# EAGLE design osbo_v10 (EAGLE 6.4)
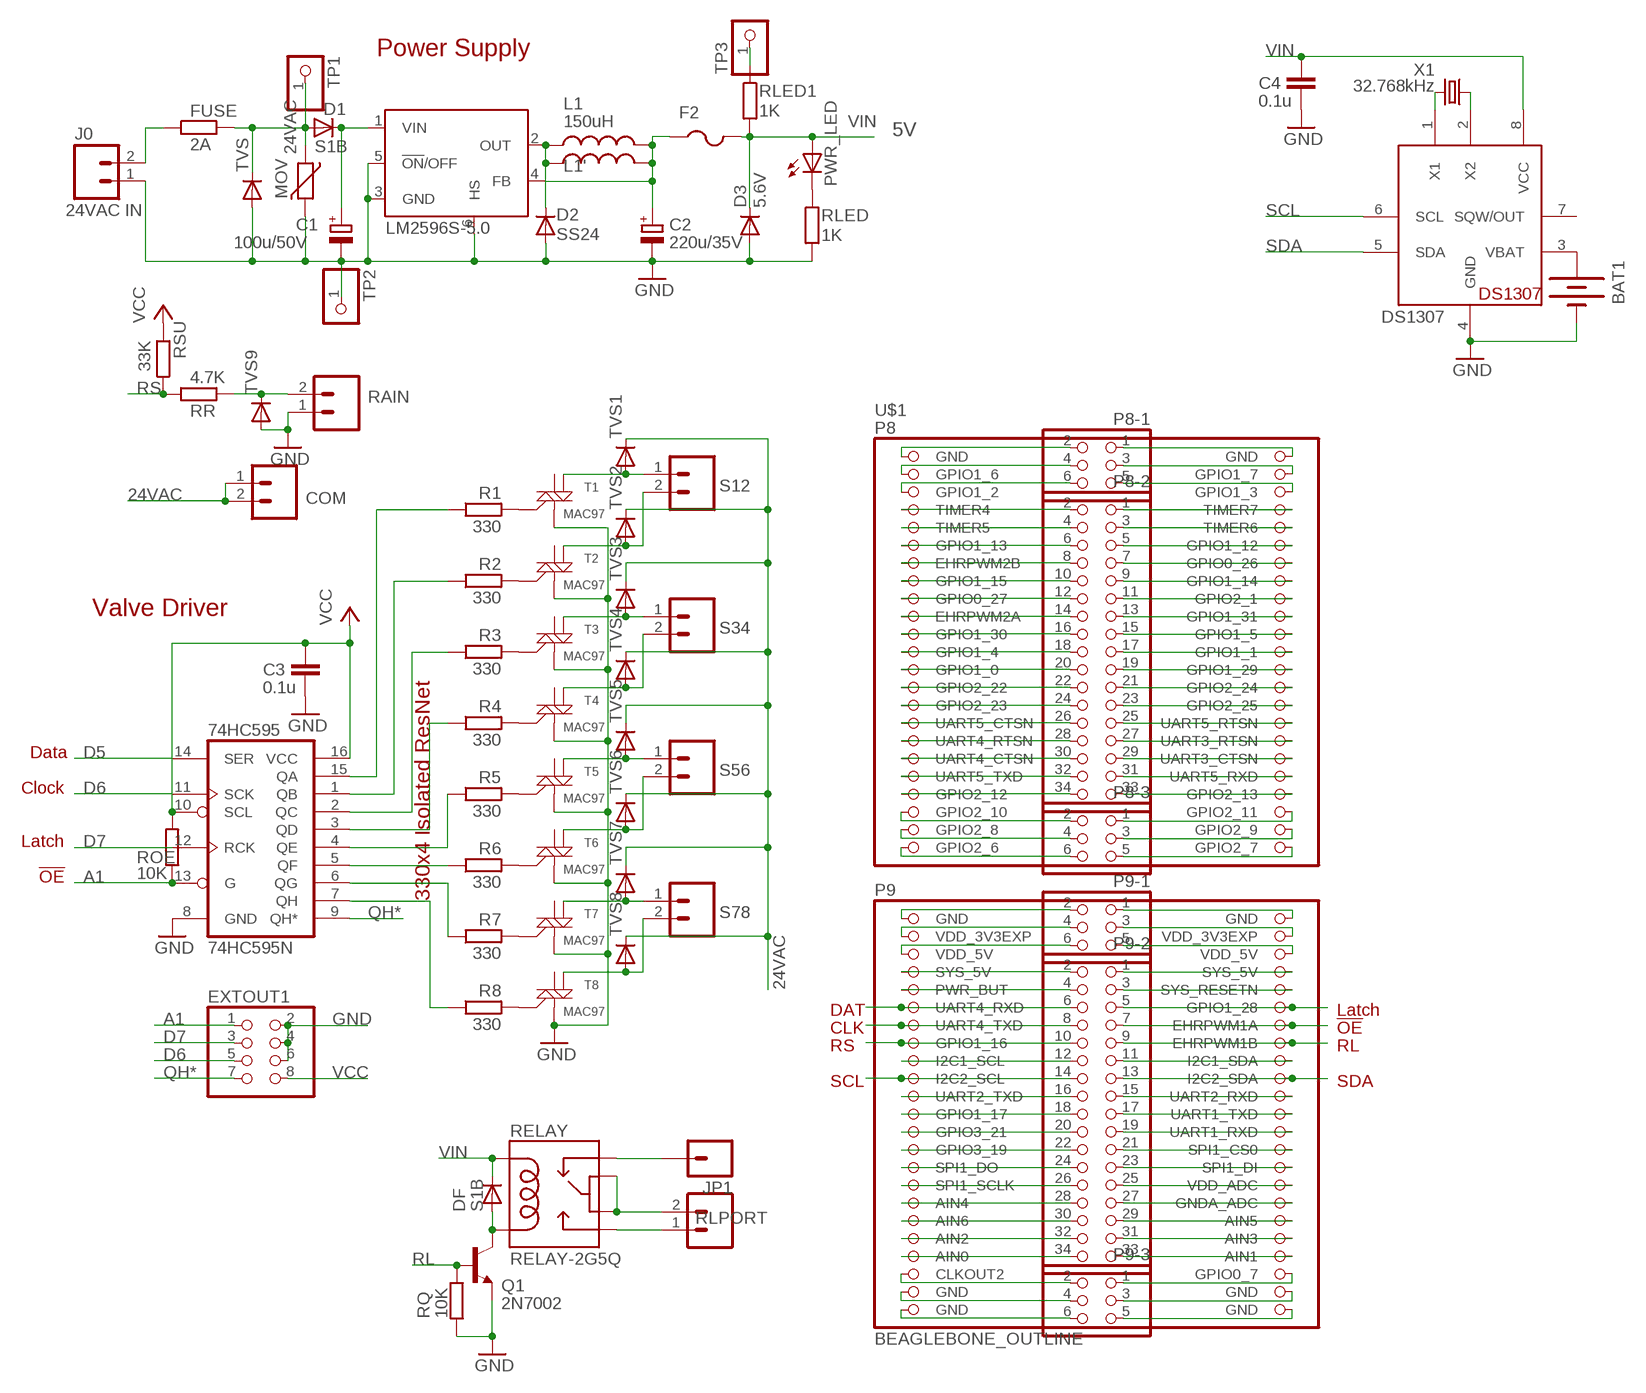
[diagram p0: schematic, sheet 1]

## Parts
74HC595  74HC595N  74LS595D  [SO16]
BAT1  BATTERYBATTERY_12MM_SMT  [BATTCON_12MM_SMT]
C1  100u/50V  CPOL-EUE  [PANASONIC_E]
C2  220u/35V  CPOL-EUE  [PANASONIC_E]
C3  0.1u  C-EUC0805  [C0805]
C4  0.1u  C-EUC0805  [C0805]
COM  M025MM-X  [SCREWTERMINAL-5MM-2-X]
D1  S1B  DIODE-DO-214AC  [DO-214AC]
D2  SS24  DIODE-SMB  [SMB]
D3  5.6V  DIODE-MINIMELF  [MINIMELF]
DF  S1B  DIODE-DO-214AC  [DO-214AC]
DS1307  DS1307  DS1307SOIC  [SO08]
EXTOUT1  PINHD-2X4/90  [2X04/90]
F2  PTCFUSE-1812  [1812]
FUSE  2A  R-EU_0411/15  [0411/15]
IC1  LM2596S-5.0  LM2596S  [TO263-5]
J0  24VAC IN  M024MM-X  [SCREWTERMINAL-4MM-2-X]
JP1  M01PTH  [1X01]
L1  150uH  INDUCTORPWR  [CDRH125]
L1'  150uH  L-US0207/7  [0207/7]
MOV  VARISTOR-5  [R-5]
P8-1  PINHD-2X3  [2X03]
P8-2  PINHD-2X17  [2X17]
P8-3  PINHD-2X3  [2X03]
P9-1  PINHD-2X3  [2X03]
P9-2  PINHD-2X17  [2X17]
P9-3  PINHD-2X3  [2X03]
PWR_LED  LEDCHIPLED_0805  [CHIPLED_0805]
Q1  2N7002  TRANSISTOR_NPNSOT23-3  [SOT23-3]
R1  330  R-EU_R0805  [R0805]
R2  330  R-EU_R0805  [R0805]
R3  330  R-EU_R0805  [R0805]
R4  330  R-EU_R0805  [R0805]
R5  330  R-EU_R0805  [R0805]
R6  330  R-EU_R0805  [R0805]
R7  330  R-EU_R0805  [R0805]
R8  330  R-EU_R0805  [R0805]
RAIN  M025MM-X  [SCREWTERMINAL-5MM-2-X]
RELAY  RELAY-2G5Q  [RELAY-G5V]
RLED  1K  R-EU_R0805  [R0805]
RLED1  1K  R-EU_R0805  [R0805]
RLPORT  M025MM  [SCREWTERMINAL-5MM-2]
ROE  10K  R-EU_R0805  [R0805]
RQ  10K  R-EU_R0805  [R0805]
RR  4.7K  R-EU_R0805  [R0805]
RSU  33K  R-EU_R0805  [R0805]
S12  M025MM-X  [SCREWTERMINAL-5MM-2-X]
S34  M025MM-X  [SCREWTERMINAL-5MM-2-X]
S56  M025MM-X  [SCREWTERMINAL-5MM-2-X]
S78  M025MM-X  [SCREWTERMINAL-5MM-2-X]
T1  MAC97  MAC97SOT223  [SOT223]
T2  MAC97  MAC97SOT223  [SOT223]
T3  MAC97  MAC97SOT223  [SOT223]
T4  MAC97  MAC97SOT223  [SOT223]
T5  MAC97  MAC97SOT223  [SOT223]
T6  MAC97  MAC97SOT223  [SOT223]
T7  MAC97  MAC97SOT223  [SOT223]
T8  MAC97  MAC97SOT223  [SOT223]
TP1  PINHD-1X1CB  [1X01-CLEANBIG]
TP2  PINHD-1X1CB  [1X01-CLEANBIG]
TP3  PINHD-1X1CB  [1X01-CLEANBIG]
TVS  DIODE-SMB  [SMB]
TVS1  DIODE-SMB  [SMB]
TVS2  DIODE-SMB  [SMB]
TVS3  DIODE-SMB  [SMB]
TVS4  DIODE-SMB  [SMB]
TVS5  DIODE-SMB  [SMB]
TVS6  DIODE-SMB  [SMB]
TVS7  DIODE-SMB  [SMB]
TVS8  DIODE-SMB  [SMB]
TVS9  DIODE-SMB  [SMB]
U$1  BEAGLEBONE_OUTLINE  [BEAGLEBONE_SHIELD]
X1  32.768kHz  CRYSTALMM20SS  [MM20SS]

## Nets
24VAC [power]: COM.1 COM.2 D1.A FUSE.2 MOV.1 TP1.1 TVS1.C TVS2.C TVS3.C TVS4.C TVS5.C TVS6.C TVS7.C TVS8.C TVS.C
A1: 74HC595.13(G) EXTOUT1.1 P9-2.7 ROE.1 U$1.60(EHRPWM1A)
ACIN [power]: FUSE.1 J0.2
CO [power]: RELAY.5 RELAY.6 RLPORT.2
D5: 74HC595.14(SER) P9-2.6 U$1.57(UART4_RXD)
D6: 74HC595.11(SCK) EXTOUT1.5 P9-2.8 U$1.59(UART4_TXD)
D7: 74HC595.12(RCK) EXTOUT1.3 P9-2.5 U$1.58(GPIO1_28)
G5: R5.2 T5.3(G)
GND [power]: 74HC595.8(GND) BAT1.P$1(-) C1.- C2.- C3.2 C4.2 D2.A D3.A DS1307.4(GND) EXTOUT1.2 EXTOUT1.4 EXTOUT1.6 IC1.3(GND) IC1.5(!ON!/OFF) IC1.6(HS) J0.1 MOV.2 P9-1.1 P9-1.2 Q1.2(E) RAIN.1 RLED.2 RQ.2 T1.1(M1) T2.1(M1) T3.1(M1) T4.1(M1) T5.1(M1) T6.1(M1) T7.1(M1) T8.1(M1) TP2.1 TVS9.A TVS.A U$1.47(GND) U$1.48(GND)
I2C1_SCL: P9-2.12 U$1.63(I2C1_SCL)
I2C1_SDA: P9-2.11 U$1.64(I2C1_SDA)
N$1: PWR_LED.C RLED.1
N$2 [power]: C1.+ D1.C IC1.1(VIN)
N$3: R1.2 T1.3(G)
N$4: 74HC595.5(QF) R6.1
N$5: 74HC595.6(QG) R7.1
N$6: BAT1.P$2(+) DS1307.3(VBAT)
N$7: 74HC595.7(QH) R8.1
N$8 [power]: D2.C IC1.2(OUT) L1'.1 L1.1
N$9: P8-1.2 U$1.1(GND)
N$10: 74HC595.4(QE) R5.1
N$11: 74HC595.3(QD) R4.1
N$12: 74HC595.2(QC) R3.1
N$13: 74HC595.1(QB) R2.1
N$14: 74HC595.15(QA) R1.1
N$15: R2.2 T2.3(G)
N$16 [power]: S12.1 T1.4(M2-4) TVS1.A
N$17 [power]: S12.2 T2.4(M2-4) TVS2.A
N$18 [power]: S34.1 T3.4(M2-4) TVS3.A
N$19: R3.2 T3.3(G)
N$20 [power]: S34.2 T4.4(M2-4) TVS4.A
N$21: R4.2 T4.3(G)
N$22 [power]: S56.1 T5.4(M2-4) TVS5.A
N$23 [power]: S56.2 T6.4(M2-4) TVS6.A
N$24 [power]: S78.1 T7.4(M2-4) TVS7.A
N$25 [power]: S78.2 T8.4(M2-4) TVS8.A
N$26: RAIN.2 RR.1 TVS9.C
N$27: R6.2 T6.3(G)
N$28: R7.2 T7.3(G)
N$29: R8.2 T8.3(G)
N$30: P8-1.1 U$1.2(GND)
N$31: DS1307.1(X1) X1.1
N$32: P8-1.4 U$1.3(GPIO1_6)
N$33: P8-1.3 U$1.4(GPIO1_7)
N$34: P8-1.6 U$1.5(GPIO1_2)
N$35: P8-1.5 U$1.6(GPIO1_3)
N$36: P8-3.6 U$1.45(GPIO2_6)
N$37: P8-3.5 U$1.46(GPIO2_7)
N$38: P8-3.4 U$1.43(GPIO2_8)
N$39: P8-3.2 U$1.41(GPIO2_10)
N$40: P8-3.3 U$1.44(GPIO2_9)
N$41: P8-3.1 U$1.42(GPIO2_11)
N$42: P8-2.2 U$1.7(TIMER4)
N$43: P8-2.4 U$1.9(TIMER5)
N$44: P8-2.6 U$1.11(GPIO1_13)
N$45: P8-2.8 U$1.13(EHRPWM2B)
N$46: P8-2.10 U$1.15(GPIO1_15)
N$47: P8-2.12 U$1.17(GPIO0_27)
N$48: P8-2.14 U$1.19(EHRPWM2A)
N$49: P8-2.16 U$1.21(GPIO1_30)
N$50: P8-2.18 U$1.23(GPIO1_4)
N$51: P8-2.20 U$1.25(GPIO1_0)
N$52: P8-2.22 U$1.27(GPIO2_22)
N$53: P8-2.24 U$1.29(GPIO2_23)
N$54: P8-2.26 U$1.31(UART5_CTSN)
N$55: P8-2.28 U$1.33(UART4_RTSN)
N$56: P8-2.30 U$1.35(UART4_CTSN)
N$57: P8-2.32 U$1.37(UART5_TXD)
N$58: P8-2.34 U$1.39(GPIO2_12)
N$59: P8-2.1 U$1.8(TIMER7)
N$60: P8-2.3 U$1.10(TIMER6)
N$61: P8-2.5 U$1.12(GPIO1_12)
N$62: P8-2.7 U$1.14(GPIO0_26)
N$63: P8-2.9 U$1.16(GPIO1_14)
N$64: P8-2.11 U$1.18(GPIO2_1)
N$65: P8-2.13 U$1.20(GPIO1_31)
N$66: P8-2.15 U$1.22(GPIO1_5)
N$67: P8-2.17 U$1.24(GPIO1_1)
N$68: P8-2.19 U$1.26(GPIO1_29)
N$69: P8-2.21 U$1.28(GPIO2_24)
N$70: P8-2.23 U$1.30(GPIO2_25)
N$71: P8-2.25 U$1.32(UART5_RTSN)
N$72: P8-2.27 U$1.34(UART3_RTSN)
N$73: P8-2.29 U$1.36(UART3_CTSN)
N$74: P8-2.31 U$1.38(UART5_RXD)
N$75: P8-2.33 U$1.40(GPIO2_13)
N$76: DS1307.2(X2) X1.4
N$77 [power]: DF.A Q1.3(C) RELAY.9
N$78 [power]: RLED1.1 TP3.1
N$82: P9-3.6 U$1.91(GND)
N$83: P9-3.4 U$1.89(GND)
N$84: P9-3.2 U$1.87(CLKOUT2)
N$85: P9-3.5 U$1.92(GND)
N$86: P9-3.3 U$1.90(GND)
N$87: P9-3.1 U$1.88(GPIO0_7)
N$95: P9-2.15 U$1.68(UART2_RXD)
N$96: P9-2.17 U$1.70(UART1_TXD)
N$97: P9-2.19 U$1.72(UART1_RXD)
N$98: P9-2.21 U$1.74(SPI1_CS0)
N$99: P9-2.23 U$1.76(SPI1_DI)
N$100: P9-2.25 U$1.78(VDD_ADC)
N$101: P9-2.27 U$1.80(GNDA_ADC)
N$102: P9-2.29 U$1.82(AIN5)
N$103: P9-2.31 U$1.84(AIN3)
N$104: P9-2.33 U$1.86(AIN1)
N$112: P9-2.16 U$1.67(UART2_TXD)
N$113: P9-2.18 U$1.69(GPIO1_17)
N$114: P9-2.20 U$1.71(GPIO3_21)
N$115: P9-2.22 U$1.73(GPIO3_19)
N$116: P9-2.24 U$1.75(SPI1_DO)
N$117: P9-2.26 U$1.77(SPI1_SCLK)
N$118: P9-2.28 U$1.79(AIN4)
N$119: P9-2.30 U$1.81(AIN6)
N$120: P9-2.32 U$1.83(AIN2)
N$121: P9-2.34 U$1.85(AIN0)
NC [power]: JP1.1 RELAY.1
NO [power]: RELAY.10 RLPORT.1
PWR_BUT: P9-2.4 U$1.55(PWR_BUT)
QH*: 74HC595.9(QH*) EXTOUT1.7
RL: P9-2.9 Q1.1(B) RQ.1 U$1.62(EHRPWM1B)
RS: P9-2.10 RR.2 RSU.1 U$1.61(GPIO1_16)
SCL: DS1307.6(SCL) P9-2.14 U$1.65(I2C2_SCL)
SDA: DS1307.5(SDA) P9-2.13 U$1.66(I2C2_SDA)
SYS_5V [power]: P9-2.1 P9-2.2 U$1.53(SYS_5V) U$1.54(SYS_5V)
SYS_RESET [power]: P9-2.3 U$1.56(SYS_RESETN)
VCC: 74HC595.10(SCL) 74HC595.16(VCC) C3.1 EXTOUT1.8 P9-1.3 P9-1.4 ROE.2 RSU.2 U$1.49(VDD_3V3EXP) U$1.50(VDD_3V3EXP)
VIN [power]: C4.1 D3.C DF.C DS1307.8(VCC) F2.2 P9-1.5 P9-1.6 PWR_LED.A RELAY.2 RLED1.2 U$1.51(VDD_5V) U$1.52(VDD_5V)
VIN_PRE [power]: C2.+ F2.1 IC1.4(FB) L1'.2 L1.2
Unconnected: DS1307.7(SQW/OUT) T1.2(M2) T2.2(M2) T3.2(M2) T4.2(M2) T5.2(M2) T6.2(M2) T7.2(M2) T8.2(M2)

## Notes on the sheet
- Power Supply
- 5V
- Valve Driver
- Data
- Clock
- Latch
- !OE
- 330x4 Isolated ResNet
- DAT | Latch
- CLK | !OE
- RS | RL
- SCL | SDA

## Library data of the parts
74HC595 = SparkFun:74*595: 8-bit SHIFT REGISTER, output latch
BAT1 = SparkFunNew:BATTERY: Battery Holders Various common sizes : AA, AAA, 20mm coin cell and 12mm coin cell.
C1 C2 = resistor:CPOL-EU: POLARIZED CAPACITOR, European symbol
C3 C4 = rcl:C-EU: CAPACITOR, European symbol
COM J0 RAIN RLPORT S12 S34 S56 S78 = SparkFun:M02: Header 2 Standard 2-pin 0.1" header. Use with straight break away headers (SKU : PRT-00116), right angle break away headers (PRT-00553), swiss pins (PRT-00743), machine pins (PRT-00117), and female headers (PRT-00115). Molex polarized connector foot print use with SKU : PRT-08233 with associated crimp pins and housings.
D1-D3 DF TVS TVS1-TVS9 = diode:DIODE-: DIODE
DS1307 = adafruit:DS1307: DS1307 Real time clock (RTC) with battery backup ability. Talk to it via i2c
EXTOUT1 = pinhead:PINHD-2X4: PIN HEADER
F2 = adafruit:PTCFUSE: PTC fuses, resettable thermistors
FUSE R1-R8 RLED RLED1 ROE RQ RR RSU = rcl:R-EU_: RESISTOR, European symbol
IC1 = national-semiconductor:LM2596: SIMPLE SWITCHER® Power Converter 150 kHz 3A Step-Down Voltage Regulator Source: http://www.national.com/ds/LM/LM2596.pdf; MF: NATIONAL SEMICONDUCTOR; MPN: LM2596S-ADJ/NOPB; OC_FARNELL: 9494367; OC_NEWARK: 41K3842
JP1 = SparkFun:M01: Header 1 Standard 1-pin 0.1" header. Use with straight break away headers (SKU : PRT-00116), right angle break away headers (PRT-00553), swiss pins (PRT-00743), machine pins (PRT-00117), and female headers (PRT-00115).
L1 = SparkFunNew:INDUCTOR: Inductors Basic Inductor/Choke - 0603 and 1206. Footprints are not proven and vary greatly between part numbers.
L1' = rcl:L-US: INDUCTOR, American symbol
MOV = varistor:VARISTOR: VARISTOR
P8-1 P8-3 P9-1 P9-3 = pinhead:PINHD-2X3: PIN HEADER
P8-2 P9-2 = pinhead:PINHD-2X17: PIN HEADER
PWR_LED = adafruit:LED: LED OSRAM: - CHIPLED LG R971, LG N971, LY N971, LG Q971, LY Q971, LO R971, LY R971 LH N974, LH R974 LS Q976, LO Q976, LY Q976 LO Q996 - Hyper CHIPLED LW Q18S LB Q993, LB Q99A, LB R99A - SideLED LS A670, LO A670, LY A670, LG A670, LP A670 LB A673, LV A673, LT A673, LW A673 LH A674 LY A675 LS A676, LA A676, LO A676, LY A676, LW A676 LS A679, LY A679, LG A679 - Hyper Micro SIDELED® LS Y876, LA Y876, LO Y876, LY Y876 LT Y87S - SmartLED LW L88C, LW L88S LB L89C, LB L89S, LG L890 LS L89K, LO L89K, LY L89K LS L896, LA L896, LO L896, LY L896 - TOPLED LS T670, LO T670, LY T670, LG T670, LP T670 LSG T670, LSP T670, LSY T670, LOP T670, LYG T670 LG T671, LOG T671, LSG T671 LB T673, LV T673, LT T673, LW T673 LH T674 LS T676, LA T676, LO T676, LY T676, LB T676, LH T676, LSB T676, LW T676 LB T67C, LV T67C, LT T67C, LS T67K, LO T67K, LY T67K, LW E67C LS E67B, LA E67B, LO E67B, LY E67B, LB E67C, LV E67C, LT E67C LW T67C LS T679, LY T679, LG T679 LS T770, LO T770, LY T770, LG T770, LP T770 LB T773, LV T773, LT T773, LW T773 LH T774 LS E675, LA E675, LY E675, LS T675 LS T776, LA T776, LO T776, LY T776, LB T776 LHGB T686 LT T68C, LB T68C - Hyper Mini TOPLED® LB M676 - Mini TOPLED Santana® LG M470 LS M47K, LO M47K, LY M47K Source: http://www.osram.convergy.de/
Q1 = SparkFunNew:TRANSISTOR_NPN: Transistor NPN BJT configuration in SOT23 package. MMBT2222 is the common NPN we use. Double check BCE configuration again layout.
RELAY = SparkFunNew:RELAY-2
T1-T8 = SparkFun:MAC97: MAC97 Triac http://www.onsemi.com/pub_link/Collateral/MAC97-D.PDF
TP1-TP3 = adafruit:PINHD-1X1: Pin header 1x1 for 0.1" spacing With round pins
U$1 = adafruit2013:BEAGLEBONE_OUTLINE: Should match A3 pinout - but not completely tested
X1 = crystal:CRYSTAL: CRYSTAL; OC_FARNELL: unknown; OC_NEWARK: unknown

## Net classes
0 default: width 0.254 mm, clearance 0.203 mm
1 power: width 0.508 mm, clearance 0.203 mm

## Board
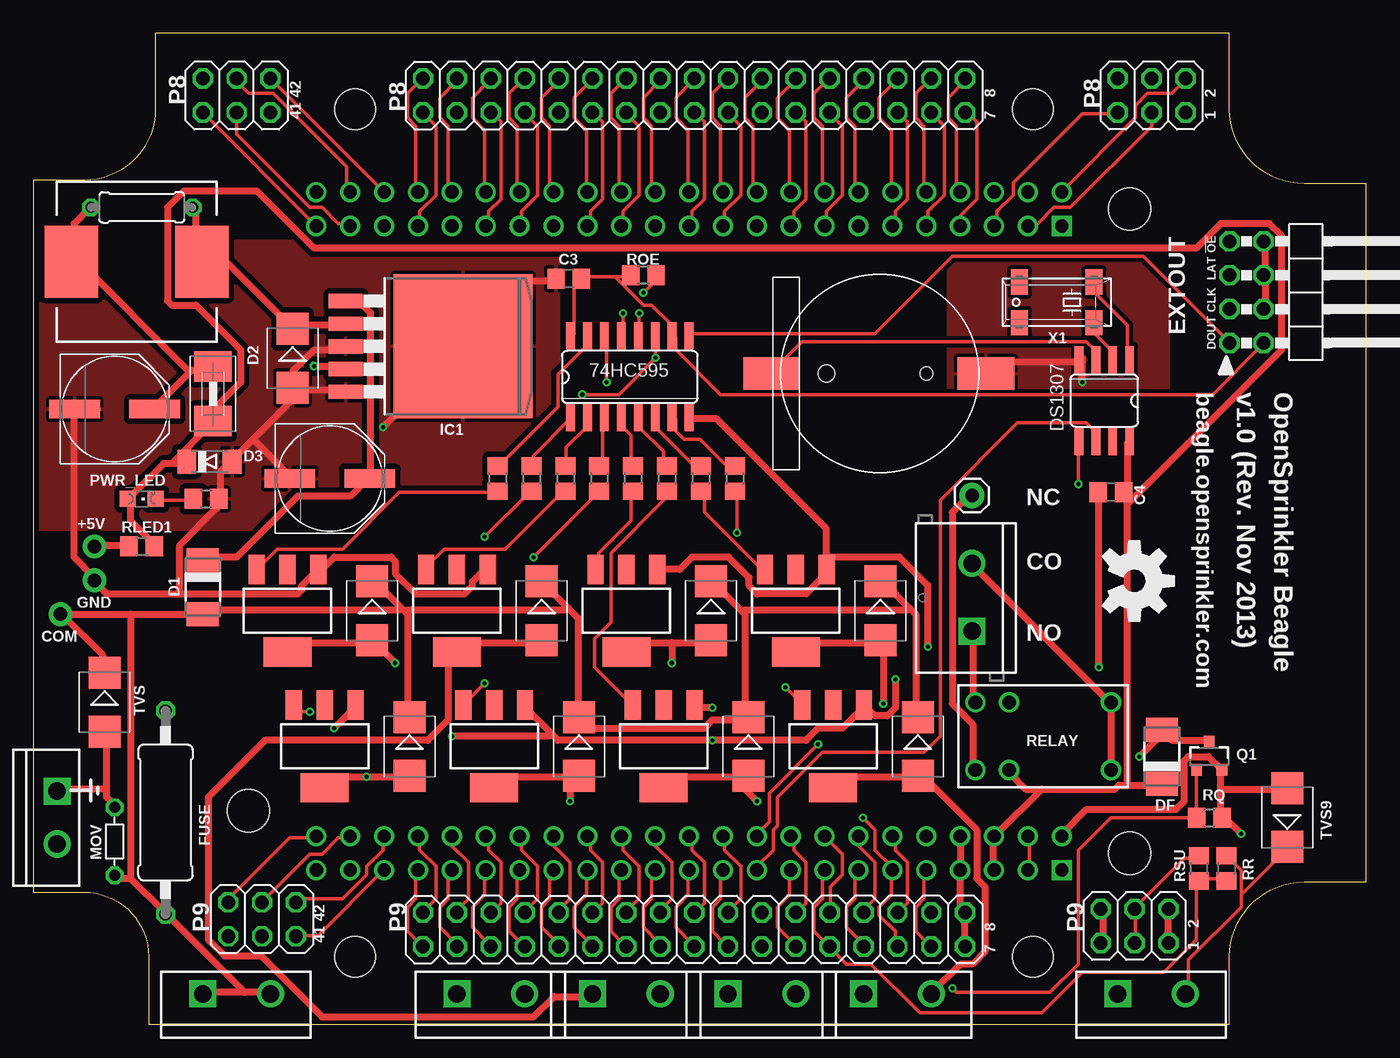
[diagram p1: board, top side]
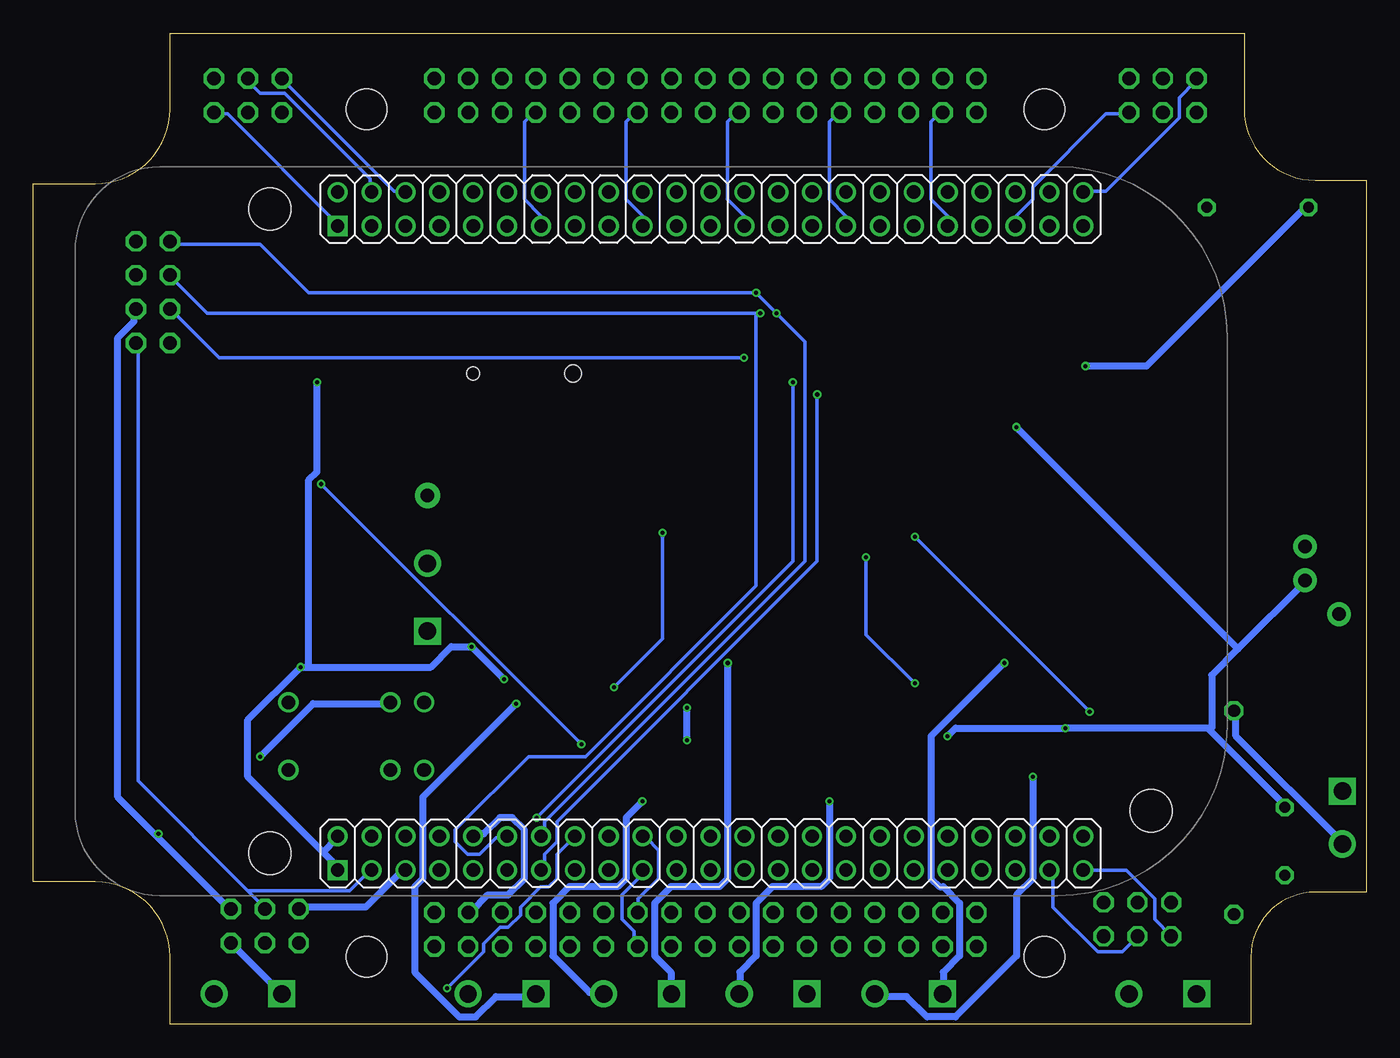
[diagram p2: board, bottom side, seen from below]

Size 99.9 x 74.25 mm. Coordinates in mm from the lower left corner, seen from the top.
Outline: 8.64,0 89.66,0 89.66,5.08 arc-90 95.25,10.67 99.9,10.67 99.9,62.99 95.25,62.99 arc-90 89.66,68.58 89.66,74.25 9.14,74.25 9.14,68.58 arc-90 3.81,63.25 0,63.25 0,9.91 3.81,9.91 arc-90 8.64,5.08 8.64,0
Copper layers (1*16): Top 0.035mm / dielectric 1.5mm / Bottom 0.035mm
Design rules "Fusion_eagle_rule_v1.1": minimum track width 6mil, minimum drill 12mil, track to track 6mil, track to pad 6mil, pad to pad 6mil, via to via 6mil, smd to smd 0mil, copper to edge 10mil, drill to drill 10mil, minimum pad ring 10mil, minimum via ring 6mil, stop-mask expansion 2mil, vias tented up to drill 100mil, thermal gap 10mil
Holes 3.05 mm at 24.13,5.08 74.93,5.08 24.13,68.58 74.93,68.58
tRestrict: area 21.6,2.5 to 26.7,7.6; area 72.4,2.5 to 77.5,7.6; area 21.6,66 to 26.7,71.1; area 72.4,66 to 77.5,71.1; area 13.6,13.5 to 18.7,18.5; area 79.6,10.3 to 84.7,15.4; area 79.6,58.5 to 84.7,63.6
bRestrict: area 79.6,58.5 to 84.7,63.6; area 79.6,10.3 to 84.7,15.4; area 13.6,13.5 to 18.7,18.5

### Footprints (pad centres in the part's own frame; a part is rotated, then mirrored left to right if it is on the bottom)
SO16 = smd 0.66 x 2.032: 1 -4.445,-3.073; 2 -3.175,-3.073; 3 -1.905,-3.073; 4 -0.635,-3.073; 5 0.635,-3.073; 6 1.905,-3.073; 7 3.175,-3.073; 8 4.445,-3.073; 9 4.445,3.073; 10 3.175,3.073; 11 1.905,3.073; 12 0.635,3.073; 13 -0.635,3.073; 14 -1.905,3.073; 15 -3.175,3.073; 16 -4.445,3.073
BATTCON_12MM_SMT = smd 2.4 x 4.3: P$1 0,11.96 | smd 2.4 x 4.2: P$2 0,-4.1 | hole 0.95: 0,7.5 | hole 1.25: 0,0
PANASONIC_E = smd 3.8 x 1.4: + 3,0; - -3,0
C0805 = smd 1.3 x 1.5: 1 -0.95,0; 2 0.95,0
SCREWTERMINAL-5MM-2-X = drill 1.3 pad 2.032 square: 1 0,0 | drill 1.3 pad 2.032: 2 5.08,0
DO-214AC = smd 1.8 x 2.4: A 2.025,0; C -2.025,0
SMB = smd 2.4 x 2.4: A 2.2,0; C -2.2,0
MINIMELF = smd 1.4 x 1.8: A 1.7,0; C -1.7,0
SO08 = smd 0.66 x 2.032: 1 -1.905,-3.073; 2 -0.635,-3.073; 3 0.635,-3.073; 4 1.905,-3.073; 5 1.905,3.073; 6 0.635,3.073; 7 -0.635,3.073; 8 -1.905,3.073
2X04/90 = drill 1.016 octagon: 1 -3.81,-6.35; 2 -3.81,-3.81; 3 -1.27,-6.35; 4 -1.27,-3.81; 5 1.27,-6.35; 6 1.27,-3.81; 7 3.81,-6.35; 8 3.81,-3.81
1812 = smd 2.286 x 2.794: 1 -2.046,0; 2 2.046,0
0411/15 = drill 0.914 octagon: 1 -7.62,0; 2 7.62,0
TO263-5 = smd 1.067 x 2.54: 1 -3.404,-5.791; 2 -1.702,-5.791; 3 0,-5.791; 4 1.702,-5.791; 5 3.404,-5.791 | smd 10.8 x 10.41: 6 0,3
SCREWTERMINAL-4MM-2-X = drill 1.3 pad 2.032 square: 1 0,0 | drill 1.3 pad 2.032: 2 3.96,0
1X01 = drill 1.016 pad 1.88: 1 0,0
CDRH125 = smd 5.4 x 4: 1 0,4.9; 2 0,-4.9
0207/7 = drill 0.813 octagon: 1 -3.81,0; 2 3.81,0
R-5 = drill 0.813 octagon: 1 -2.54,0; 2 2.54,0
2X03 = drill 1.016 octagon: 1 -2.54,-1.27; 2 -2.54,1.27; 3 0,-1.27; 4 0,1.27; 5 2.54,-1.27; 6 2.54,1.27
2X17 = drill 1.016 octagon: 1 -20.32,-1.27; 2 -20.32,1.27; 3 -17.78,-1.27; 4 -17.78,1.27; 5 -15.24,-1.27; 6 -15.24,1.27; 7 -12.7,-1.27; 8 -12.7,1.27; 9 -10.16,-1.27; 10 -10.16,1.27; 11 -7.62,-1.27; 12 -7.62,1.27; 13 -5.08,-1.27; 14 -5.08,1.27; 15 -2.54,-1.27; 16 -2.54,1.27; 17 0,-1.27; 18 0,1.27; 19 2.54,-1.27; 20 2.54,1.27; 21 5.08,-1.27; 22 5.08,1.27; 23 7.62,-1.27; 24 7.62,1.27; 25 10.16,-1.27; 26 10.16,1.27; 27 12.7,-1.27; 28 12.7,1.27; 29 15.24,-1.27; 30 15.24,1.27; 31 17.78,-1.27; 32 17.78,1.27; 33 20.32,-1.27; 34 20.32,1.27
CHIPLED_0805 = smd 1.2 x 1.2: A 0,-1.05; C 0,1.05
SOT23-3 = smd 0.8 x 0.9: 1 -0.95,-1; 2 0.95,-1; 3 0,1.1
R0805 = smd 1.3 x 1.5: 1 -0.95,0; 2 0.95,0
RELAY-G5V = drill 1.016: 1 5.08,2.54; 2 2.54,2.54; 5 -5.08,2.54; 6 -5.08,-2.54; 9 2.54,-2.54; 10 5.08,-2.54
SCREWTERMINAL-5MM-2 = drill 1.3 pad 2.032 square: 1 0,0 | drill 1.3 pad 2.032: 2 5.08,0
SOT223 = smd 1.219 x 2.235: 1 -2.311,-3.099; 2 0,-3.099; 3 2.311,-3.099 | smd 3.6 x 2.2: 4 0,3.099
1X01-CLEANBIG = drill 1.016 pad 1.778: 1 0,0
BEAGLEBONE_SHIELD = drill 1 square: 1 19.685,50.165; 47 19.685,1.905 | drill 1: 2 19.685,52.705; 3 22.225,50.165; 4 22.225,52.705; 5 24.765,50.165; 6 24.765,52.705; 7 27.305,50.165; 8 27.305,52.705; 9 29.845,50.165; 10 29.845,52.705; 11 32.385,50.165; 12 32.385,52.705; 13 34.925,50.165; 14 34.925,52.705; 15 37.465,50.165; 16 37.465,52.705; 17 40.005,50.165; 18 40.005,52.705; 19 42.545,50.165; 20 42.545,52.705; 21 45.085,50.165; 22 45.085,52.705; 23 47.625,50.165; 24 47.625,52.705; 25 50.165,50.165; 26 50.165,52.705; 27 52.705,50.165; 28 52.705,52.705; 29 55.245,50.165; 30 55.245,52.705; 31 57.785,50.165; 32 57.785,52.705; 33 60.325,50.165; 34 60.325,52.705; 35 62.865,50.165; 36 62.865,52.705; 37 65.405,50.165; 38 65.405,52.705; 39 67.945,50.165; 40 67.945,52.705; 41 70.485,50.165; 42 70.485,52.705; 43 73.025,50.165; 44 73.025,52.705; 45 75.565,50.165; 46 75.565,52.705; 48 19.685,4.445; 49 22.225,1.905; 50 22.225,4.445; 51 24.765,1.905; 52 24.765,4.445; 53 27.305,1.905; 54 27.305,4.445; 55 29.845,1.905; 56 29.845,4.445; 57 32.385,1.905; 58 32.385,4.445; 59 34.925,1.905; 60 34.925,4.445; 61 37.465,1.905; 62 37.465,4.445; 63 40.005,1.905; 64 40.005,4.445; 65 42.545,1.905; 66 42.545,4.445; 67 45.085,1.905; 68 45.085,4.445; 69 47.625,1.905; 70 47.625,4.445; 71 50.165,1.905; 72 50.165,4.445; 73 52.705,1.905; 74 52.705,4.445; 75 55.245,1.905; 76 55.245,4.445; 77 57.785,1.905; 78 57.785,4.445; 79 60.325,1.905; 80 60.325,4.445; 81 62.865,1.905; 82 62.865,4.445; 83 65.405,1.905; 84 65.405,4.445; 85 67.945,1.905; 86 67.945,4.445; 87 70.485,1.905; 88 70.485,4.445; 89 73.025,1.905; 90 73.025,4.445; 91 75.565,1.905; 92 75.565,4.445 | hole 3.175: 14.605,3.175; 14.605,51.435; 80.645,6.35
MM20SS = smd 1.27 x 1.88: 1 -2.794,-1.524; 2 2.794,-1.524; 3 2.794,1.524; 4 -2.794,1.524

### Placement (x,y rotation side)
74HC595  44.7,48.51 0 top
BAT1  59.44,48.77 270 top
C1  22.23,40.89 0 top
C2  6.1,46.1 0 top
C3  40.13,55.88 180 top
C4  80.77,39.88 180 top
COM  12.7,2.29 0 top
D1  12.7,32.77 270 top
D2  19.43,49.91 270 top
D3  13.21,42.16 0 top
DF  84.58,20.07 90 top
DS1307  80.26,46.74 180 top
EXTOUT1  96.01,54.86 270 top
F2  13.46,47.24 270 top
FUSE  9.91,15.88 270 top
IC1  29.21,50.8 270 top
J0  1.78,17.48 270 top
JP1  70.36,39.62 0 top
L1  7.75,57.15 270 top
L1'  8.13,61.21 180 top
MOV  6.1,13.72 90 top
P8-1  83.82,69.6 180 top
P8-2  49.53,69.6 180 top
P8-3  15.24,69.6 180 top
P9-1  82.55,7.37 180 top
P9-2  49.53,7.11 180 top
P9-3  17.14,7.87 180 top
PWR_LED  8.13,39.37 270 top
Q1  88.14,20.07 0 top
R1  34.8,40.89 270 top
R2  37.34,40.89 270 top
R3  39.88,40.89 270 top
R4  42.42,40.89 270 top
R5  44.96,40.89 270 top
R6  47.5,40.89 270 top
R7  50.04,40.89 270 top
R8  52.58,40.89 270 top
RAIN  81.28,2.29 0 top
RELAY  75.69,21.59 180 top
RLED  12.95,39.37 0 top
RLED1  8.13,35.81 0 top
RLPORT  70.36,29.46 90 top
ROE  45.72,56.13 180 top
RQ  88.14,15.49 0 top
RR  89.41,11.68 270 top
RSU  87.38,11.68 90 top
S12  31.75,2.29 0 top
S34  41.91,2.29 0 top
S56  52.07,2.29 0 top
S78  62.23,2.29 0 top
T1  19.05,30.99 180 top
T2  21.84,20.83 180 top
T3  31.75,30.99 180 top
T4  34.54,20.83 180 top
T5  44.45,30.99 180 top
T6  47.24,20.83 180 top
T7  57.15,30.99 180 top
T8  59.94,20.83 180 top
TP1  2.03,30.73 0 top
TP2  4.57,33.27 0 top
TP3  4.57,35.81 0 top
TVS  5.33,24.13 270 top
TVS1  25.4,30.99 270 top
TVS2  28.19,20.83 270 top
TVS3  38.1,30.99 270 top
TVS4  40.89,20.83 270 top
TVS5  50.8,30.99 270 top
TVS6  53.59,20.83 270 top
TVS7  63.5,30.99 270 top
TVS8  66.29,20.83 270 top
TVS9  93.98,15.49 90 top
U$1  96.77,9.65 0 bottom
X1  76.71,54.1 180 top

### Tracks (layer width: path | path; a pad name or v marks a point on that pad's centre or on a via)
24VAC
  Top 0.508: 53.19,30.89 50.9,33.17 TVS5.C | 53.19,30.89 53.34,30.73 53.34,23.11 TVS6.C 53.34,22.81 50.9,22.81 50.29,22.2 41.76,22.2 41.15,22.81 TVS4.C 40.84,23.11 40.84,30.43 40.08,31.19 | 65.68,31.19 63.7,33.17 TVS7.C | 65.68,31.19 66.14,30.73 66.14,23.11 TVS8.C | 53.19,30.89 53.34,31.04 65.53,31.04 65.68,31.19 | 7.32,10.92 6.1,10.92 MOV.1 | 7.32,10.92 9.75,8.48 FUSE.2 10.06,8.18 15.85,2.39 | 15.85,2.39 17.68,2.39 COM.2 | 15.85,2.39 12.8,2.39 COM.1 | TVS.C 5.18,26.47 5.18,27.69 2.13,30.73 TP1.1 7.32,30.73 | 7.32,30.73 12.5,30.73 D1.A 12.8,31.04 27.43,31.04 27.58,31.19 | 27.58,31.19 25.6,33.17 TVS1.C | 27.58,31.19 27.89,30.89 | 27.89,30.89 28.04,30.73 28.04,23.11 TVS2.C | 40.08,31.19 38.1,33.17 TVS3.C | 27.89,30.89 28.04,31.04 39.93,31.04 40.08,31.19 | 7.32,30.73 7.32,10.92
A1  (via drill 0.3)
  Top 0.254: U$1.60 61.87,13.97 61.87,13.36 63.09,12.14 63.09,9.4 62.18,8.48 P9-2.7 | v44.2,53.29 44.2,51.77 74HC595.13 | v45.72,54.81 46.94,56.03 ROE.1
  Bottom 0.254: U$1.60 61.57,14.28 61.57,15.19 42.06,34.7 42.06,51.16 v44.2,53.29 v45.72,54.81 79.25,54.81 82.91,58.47 89.61,58.47 EXTOUT1.1
ACIN
  Bottom 0.508: FUSE.1 9.75,23.42 9.75,21.59 1.83,13.66 J0.2
CO
  Top 0.508: 80.77,24.03 RELAY.5 | 80.77,24.03 70.41,34.39 RLPORT.2 | 80.77,24.03 RELAY.6
D5  (via drill 0.3)
  Top 0.254: v42.98,48.11 42.98,51.46 74HC595.14 | v62.18,15.49 63.09,14.58 63.09,13.06 64.31,11.84 U$1.57 64.31,11.53 64.31,9.7 63.4,8.79 63.4,8.18 64.62,6.96 64.62,6.04 P9-2.6
  Bottom 0.254: v42.98,48.11 42.98,34.7 v62.18,15.49
D6  (via drill 0.3)
  Top 0.254: U$1.59 61.57,11.53 61.57,9.4 60.96,8.79 60.96,7.26 62.18,6.04 P9-2.8 | 74HC595.11 46.63,51.46 v46.63,49.94 43.89,47.19 v41.15,47.19
  Bottom 0.254: v46.63,49.94 85.95,49.94 89.61,53.59 EXTOUT1.5 | v41.15,47.19 41.15,34.7 60.66,15.19 60.66,13.66 61.57,12.75 61.57,11.84 U$1.59
D7  (via drill 0.3)
  Top 0.254: U$1.58 64.62,13.97 64.62,13.06 65.53,12.14 65.53,9.09 64.92,8.48 P9-2.5 | v45.41,53.29 45.41,51.77 74HC595.12
  Bottom 0.254: 45.72,53.29 86.87,53.29 89.61,56.03 EXTOUT1.3 | 45.72,53.29 v45.41,53.29 | 45.72,53.29 45.72,32.87 58.52,20.07 62.79,20.07 68.28,14.58 68.28,13.66 67.36,12.75 66.45,12.75 65.23,13.97 64.62,13.97 U$1.58
G5
  Top 0.254: R5.2 44.81,39.88 44.81,37.74 42.37,35.31 42.37,34.09 T5.3
GND  (via drill 0.3)
  Top 0.508: 20.12,47.5 23.16,47.5 IC1.5 | 20.12,47.5 19.51,47.5 D2.A | IC1.3 23.16,50.55 21.03,50.55 19.51,49.02 19.51,47.8 D2.A | T3.1 33.83,34.09 32.92,33.17 32.92,32.87 32.31,32.26 28.65,32.26 27.13,33.78 27.13,34.7 26.82,35 22.55,35 21.64,34.09 T1.1 21.34,34.09 20.12,32.87 20.12,32.56 19.81,32.26 10.97,32.26 | C3.2 39.01,55.73 37.19,55.73 32.31,50.85 IC1.6 32,50.55 v26.21,44.75 | 5.49,17.63 5.49,17.02 6.1,16.41 MOV.2 | 5.49,17.63 5.49,21.89 TVS.A | 5.49,17.63 1.83,17.63 J0.1 | EXTOUT1.6 92.35,53.59 92.35,56.03 EXTOUT1.4 92.35,56.34 92.35,58.47 EXTOUT1.2 | P9-1.2 85.04,6.35 85.04,8.48 P9-1.1 | T5.1 48.46,34.09 49.38,35 52.12,35 53.65,33.48 53.65,32.87 54.25,32.26 57.91,32.26 59.74,34.09 T7.1 | 89,17.63 89,15.49 RQ.2 89.31,15.49 v90.53,14.28 | 89,17.63 89,18.85 Q1.2 89,19.15 88.09,20.07 86.56,20.07 86.26,19.76 86.26,16.71 85.65,16.1 78.94,16.1 77.11,14.28 U$1.48 | 78.64,49.94 DS1307.4 | DS1307.4 78.33,49.63 72.24,49.63 71.63,49.02 BAT1.P$1 | 10.97,32.26 5.49,32.26 4.57,33.17 TP2.1 4.57,33.48 3.05,35 3.05,45.97 C2.- | 20.12,47.5 16.46,43.84 | 16.46,43.84 14.94,42.32 D3.A 14.63,42.01 14.02,41.4 14.02,39.57 RLED.2 13.72,39.27 13.72,38.66 10.97,35.92 10.97,32.26 | 20.12,47.5 D2.A | 16.46,43.84 19.2,41.1 C1.- | v22.55,22.2 24.08,23.72 T2.1 | 38.86,21.74 39.32,21.29 v50.9,21.29 57.91,21.29 58.83,22.2 60.66,22.2 62.18,23.72 T8.1 62.48,23.72 63.09,23.11 64.01,23.11 64.62,23.72 v64.62,25.86 | 38.86,21.74 36.88,23.72 T4.1 | v50.9,23.72 49.68,23.72 T6.1 | 59.44,35 59.44,34.09 T7.1 | 59.44,35 59.44,37.13 51.21,45.36 49.38,45.36 74HC595.8 | v79.86,26.77 79.86,39.88 C4.2 | 59.44,35 64.92,35 67.06,32.87 v67.06,28.3
  Top 0.508: 59.44,35 T7.1 | v78.64,48.11 78.64,49.63 DS1307.4 | v31.39,21.59 38.71,21.59 38.86,21.74 | 89,17.63 93.88,17.63 TVS9.A
  Bottom 0.508: RAIN.1 P9-1.2 | 90.68,14.12 85.34,8.79 P9-1.1 | 90.68,14.12 93.57,17.02 93.57,51.46 92.35,52.68 92.35,53.59 EXTOUT1.6 | v90.53,14.28 90.68,14.12 | 11.73,22.05 6.1,16.41 MOV.2 | 11.73,22.05 11.89,22.2 v22.55,22.2 30.79,22.2 v31.39,21.59 | 9.6,28.14 4.57,33.17 TP2.1 | 9.6,28.14 11.58,26.16 11.58,22.2 11.73,22.05 | 9.6,28.14 v26.21,44.75 | v50.9,21.29 v50.9,23.72 | 78.18,12.9 77.11,11.84 U$1.47 | 78.18,12.9 83.82,18.54 83.82,22.81 v79.86,26.77 79.25,26.77 | 79.25,26.77 70.1,26.77 68.58,28.3 v67.06,28.3 v64.62,25.86 | v78.64,48.11 78.64,41.4 79.25,40.79 79.25,26.77 | 78.18,12.9 77.11,13.97 U$1.48
  pour Top (isolate 0.305): 68.58,57.4 85.09,57.4 85.09,45.97 68.58,45.97
  pour Top (isolate 0.406): 0,58.67 39.37,58.67 39.37,37.08 0,37.08
I2C1_SCL
  Top 0.254: U$1.63 56.69,11.53 56.69,9.7 55.78,8.79 55.78,7.26 57,6.04 P9-2.12
I2C1_SDA
  Top 0.254: U$1.64 57,13.97 57,13.06 57.91,12.14 57.91,9.09 57.3,8.48 P9-2.11
N$1
  Top 0.254: PWR_LED.C 9.45,39.27 11.89,39.27 RLED.1
N$2
  Top 0.508: IC1.1 24.38,54.2 25.3,53.29 25.3,41.1 C1.+ 24.99,40.79 23.77,39.57 19.81,39.57 15.24,35 12.8,35 D1.C
N$3
  Top 0.254: R1.2 34.75,39.88 27.43,39.88 23.16,35.61 18.29,35.61 16.76,34.09 T1.3
N$4
  Top 0.254: R6.1 47.24,42.01 47.24,42.93 45.41,44.75 45.41,45.36 74HC595.5
N$5
  Top 0.254: R7.1 49.99,42.01 49.38,42.01 46.63,44.75 46.63,45.36 74HC595.6
N$6
  Top 0.254: DS1307.3 79.55,49.94 79.55,50.55 78.94,51.16 57.61,51.16 55.47,49.02 BAT1.P$2
N$7
  Top 0.254: R8.1 52.43,42.01 51.82,42.01 49.99,43.84 48.77,43.84 48.16,44.45 48.16,45.36 74HC595.7
N$8
  Top 0.508: IC1.2 23.16,52.38 19.51,52.38 D2.C 19.2,52.38 12.19,59.38 | 12.19,59.38 12.19,57.56 12.5,57.25 L1.1 12.19,59.38 | 12.19,59.38 12.19,61.21 L1'.1
N$9
  Bottom 0.254: U$1.1 77.11,59.99 85.34,68.22 86.26,68.22 P8-1.2
N$10
  Top 0.254: R5.1 44.81,42.01 44.81,44.14 44.2,44.75 44.2,45.36 74HC595.4
N$11
  Top 0.254: R4.1 42.67,42.01 42.67,45.36 74HC595.3
N$12
  Top 0.254: R3.1 39.93,42.01 39.93,43.23 41.45,44.75 41.45,45.36 74HC595.2
N$13
  Top 0.254: R2.1 37.49,42.01 37.49,42.62 40.23,45.36 74HC595.1
N$14
  Top 0.254: R1.1 35.05,42.01 39.32,46.28 39.32,48.72 41.45,50.85 41.45,51.46 74HC595.15
N$15  (via drill 0.3)
  Top 0.254: v33.83,36.52 37.19,39.88 R2.2 | v20.73,23.42 20.12,23.42 19.81,23.72 T2.3
  Bottom 0.254: v20.73,23.42 v33.83,36.52
N$16  (via drill 0.3)
  Top 0.508: T1.4 19.2,27.99 19.81,28.6 25.3,28.6 TVS1.A 25.6,28.6 v27.13,27.08
  Bottom 0.508: v27.13,27.08 32.61,21.59 32.61,10.92 32,10.31 31.7,10.31 30.48,9.09 30.48,5.13 31.7,3.91 31.7,2.39 S12.1
N$17  (via drill 0.3)
  Top 0.508: TVS2.A 28.04,18.54 v24.99,18.54 22.55,18.54 21.95,17.93 T2.4
  Bottom 0.508: v24.99,18.54 24.99,10.92 26.21,9.7 26.21,5.13 30.79,0.56 32.92,0.56 34.44,2.08 36.58,2.08 S12.2
N$18
  Top 0.508: TVS3.A 38.1,28.6 32.61,28.6 32,27.99 T3.4 31.7,27.69 31.09,27.08 31.09,22.81 29.57,21.29 17.37,21.29 13.11,17.02 13.11,6.35 14.33,5.13 17.07,5.13 21.64,0.56 37.49,0.56 39.01,2.08 41.76,2.08 S34.1
N$19
  Top 0.254: R3.2 39.62,39.88 35.36,35.61 30.79,35.61 29.26,34.09 T3.3
N$20  (via drill 0.3)
  Top 0.508: 40.23,18.54 35.36,18.54 34.75,17.93 T4.4 | 40.23,18.54 40.84,18.54 TVS4.A 40.23,18.54 | 40.23,18.54 v40.23,16.71
  Bottom 0.508: v40.23,16.71 40.23,10.92 40.84,10.31 44.5,10.31 45.72,9.09 45.72,5.13 46.94,3.91 46.94,2.39 S34.2
N$21  (via drill 0.3)
  Top 0.254: v37.49,35 42.37,39.88 R4.2 | v33.83,25.55 32.31,24.03 T4.3
  Bottom 0.254: v37.49,35 37.49,29.21 v33.83,25.55
N$22  (via drill 0.3)
  Top 0.508: 47.85,28.6 45.11,28.6 44.5,27.99 T5.4 | 47.85,28.6 50.6,28.6 TVS5.A | 47.85,28.6 v47.85,27.08
  Bottom 0.508: v47.85,27.08 47.85,10.92 48.46,10.31 52.12,10.31 53.34,9.09 53.34,5.13 52.12,3.91 52.12,2.39 S56.1
N$23  (via drill 0.3)
  Top 0.508: 52.43,18.54 47.85,18.54 47.24,17.93 T6.4 | 52.43,18.54 53.34,18.54 TVS6.A 52.43,18.54 | 52.43,18.54 v54.25,16.71
  Bottom 0.508: v54.25,16.71 55.47,15.49 55.47,10.92 56.08,10.31 59.74,10.31 60.96,9.09 60.96,5.13 58.22,2.39 57.3,2.39 S56.2
N$24  (via drill 0.3)
  Top 0.508: T7.4 57.3,27.99 57.91,28.6 63.4,28.6 TVS7.A 63.7,28.6 v63.7,24.03
  Bottom 0.508: v63.7,24.03 70.71,17.02 70.71,10.92 71.32,10.31 71.32,3.91 67.97,0.56 66.75,0.56 65.23,2.08 62.48,2.08 S78.1
N$25
  Top 0.508: T8.4 60.05,17.93 60.66,18.54 66.14,18.54 TVS8.A 66.45,18.85 70.71,14.58 70.71,10.92 71.32,10.31 71.32,5.44 70.41,4.52 69.49,4.52 67.36,2.39 S78.2
N$26
  Top 0.254: 90.53,9.7 90.53,8.79 86.56,4.83 86.56,2.39 RAIN.2 | 90.53,9.7 90.53,11.53 89.61,12.45 RR.1 | 90.53,9.7 93.88,13.06 TVS9.C
N$27
  Top 0.254: R6.2 47.24,39.88 47.24,39.27 43.28,35.31 43.28,30.12 42.06,28.91 42.06,26.77 44.81,24.03 T6.3
N$28
  Top 0.254: R7.2 50.29,39.88 50.29,38.35 54.56,34.09 T7.3
N$29  (via drill 0.3)
  Top 0.254: v52.73,36.83 52.73,39.88 R8.2 | v56.39,25.25 57.61,24.03 T8.3
  Bottom 0.254: v52.73,36.83 52.73,28.91 v56.39,25.25
N$30
  Top 0.254: U$1.2 77.11,62.43 82.6,67.92 82.6,68.83 83.52,69.75 85.34,69.75 86.26,70.66 P8-1.1
N$31
  Top 0.254: X1.1 79.55,55.42 79.55,54.81 81.99,52.38 81.99,49.94 DS1307.1
N$32
  Top 0.254: P8-1.4 83.82,67.31 77.72,61.21 76.5,61.21 75.29,59.99 74.68,59.99 U$1.3
N$33
  Bottom 0.254: U$1.4 74.68,62.43 74.68,63.35 81.08,69.75 82.91,69.75 83.82,70.66 P8-1.3
N$34
  Top 0.254: U$1.5 72.24,59.99 72.24,60.91 73.46,62.13 73.46,63.04 78.64,68.22 81.08,68.22 P8-1.6
N$35
  Bottom 0.254: P8-1.5 72.85,62.43 72.24,62.43 U$1.6
N$36
  Top 0.254: P8-3.6 U$1.45
N$37
  Bottom 0.254: U$1.46 21.03,62.43 19.51,62.43 14.02,67.92 14.02,69.44 12.8,70.66 P8-3.5
N$38
  Top 0.254: P8-3.4 15.24,66.7 20.73,61.21 21.64,61.21 22.86,59.99 23.47,59.99 U$1.43
N$39
  Bottom 0.254: U$1.41 26.21,59.99 26.21,60.6 24.99,61.82 24.99,62.74 19.51,68.22 17.98,68.22 P8-3.2
N$40
  Top 0.254: U$1.44 23.47,62.43 23.47,64.26 17.98,69.75 16.15,69.75 15.24,70.66 P8-3.3
N$41
  Top 0.254: P8-3.1 U$1.42
N$42
  Top 0.254: U$1.7 69.49,59.99 69.49,60.6 70.71,61.82 70.71,67.62 70.1,68.22 P8-2.2
N$43
  Top 0.254: U$1.9 67.06,59.99 67.06,60.91 68.28,62.13 68.28,67.31 67.36,68.22 P8-2.4
N$44
  Top 0.254: U$1.11 64.62,59.99 64.62,60.91 65.53,61.82 65.53,67.62 64.92,68.22 P8-2.6
N$45
  Bottom 0.254: U$1.13 61.87,59.99 61.87,60.6 63.09,61.82 63.09,67.62 62.48,68.22 P8-2.8
N$46
  Top 0.254: U$1.15 59.44,59.99 59.44,60.91 60.66,62.13 60.66,67.31 59.74,68.22 P8-2.10
N$47
  Top 0.254: U$1.17 57,59.99 57,60.91 57.91,61.82 57.91,67.62 57.3,68.22 P8-2.12
N$48
  Bottom 0.254: U$1.19 54.25,59.99 54.25,60.6 55.47,61.82 55.47,67.62 54.86,68.22 P8-2.14
N$49
  Top 0.254: U$1.21 51.82,59.99 51.82,60.91 53.03,62.13 53.03,67.31 52.12,68.22 P8-2.16
N$50
  Top 0.254: U$1.23 49.38,59.99 49.38,60.91 50.29,61.82 50.29,67.62 49.68,68.22 P8-2.18
N$51
  Bottom 0.254: U$1.25 46.63,59.99 46.63,60.6 47.85,61.82 47.85,67.62 47.24,68.22 P8-2.20
N$52
  Top 0.254: U$1.27 44.2,59.99 44.2,60.91 45.41,62.13 45.41,67.31 44.5,68.22 P8-2.22
N$53
  Top 0.254: U$1.29 41.76,59.99 41.76,60.91 42.67,61.82 42.67,67.62 42.06,68.22 P8-2.24
N$54
  Bottom 0.254: U$1.31 39.01,59.99 39.01,60.6 40.23,61.82 40.23,67.62 39.62,68.22 P8-2.26
N$55
  Top 0.254: U$1.33 36.58,59.99 36.58,60.91 37.8,62.13 37.8,67.31 36.88,68.22 P8-2.28
N$56
  Top 0.254: U$1.35 34.14,59.99 34.14,60.91 35.05,61.82 35.05,67.62 34.44,68.22 P8-2.30
N$57
  Bottom 0.254: U$1.37 31.39,59.99 31.39,60.6 32.61,61.82 32.61,67.62 32,68.22 P8-2.32
N$58
  Top 0.254: U$1.39 28.96,59.99 28.96,60.91 30.18,62.13 30.18,67.31 29.26,68.22 P8-2.34
N$59
  Top 0.254: U$1.8 69.19,62.43 69.19,67.31 68.58,67.92 68.58,69.44 69.8,70.66 P8-2.1
N$60
  Top 0.254: U$1.10 66.75,62.43 66.75,67.31 66.14,67.92 66.14,69.75 67.06,70.66 P8-2.3
N$61
  Top 0.254: U$1.12 64.31,62.43 64.31,67.01 63.4,67.92 63.4,69.44 64.62,70.66 P8-2.5
N$62
  Top 0.254: U$1.14 61.57,62.43 61.57,67.31 60.96,67.92 60.96,69.44 62.18,70.66 P8-2.7
N$63
  Top 0.254: U$1.16 59.13,62.43 59.13,67.31 58.52,67.92 58.52,69.75 59.44,70.66 P8-2.9
N$64
  Top 0.254: U$1.18 56.69,62.43 56.69,67.01 55.78,67.92 55.78,69.44 57,70.66 P8-2.11
N$65
  Top 0.254: U$1.20 53.95,62.43 53.95,67.31 53.34,67.92 53.34,69.44 54.56,70.66 P8-2.13
N$66
  Top 0.254: U$1.22 51.51,62.43 51.51,67.31 50.9,67.92 50.9,69.75 51.82,70.66 P8-2.15
N$67
  Top 0.254: U$1.24 49.07,62.43 49.07,67.01 48.16,67.92 48.16,69.44 49.38,70.66 P8-2.17
N$68
  Top 0.254: U$1.26 46.33,62.43 46.33,67.31 45.72,67.92 45.72,69.44 46.94,70.66 P8-2.19
N$69
  Top 0.254: U$1.28 43.89,62.43 43.89,67.31 43.28,67.92 43.28,69.75 44.2,70.66 P8-2.21
N$70
  Top 0.254: U$1.30 41.45,62.43 41.45,67.01 40.54,67.92 40.54,69.44 41.76,70.66 P8-2.23
N$71
  Top 0.254: U$1.32 38.71,62.43 38.71,67.31 38.1,67.92 38.1,69.44 39.32,70.66 P8-2.25
N$72
  Top 0.254: U$1.34 36.27,62.43 36.27,67.31 35.66,67.92 35.66,69.75 36.58,70.66 P8-2.27
N$73
  Top 0.254: U$1.36 33.83,62.43 33.83,67.01 32.92,67.92 32.92,69.44 34.14,70.66 P8-2.29
N$74
  Top 0.254: U$1.38 31.09,62.43 31.09,67.31 30.48,67.92 30.48,69.44 31.7,70.66 P8-2.31
N$75
  Top 0.254: U$1.40 28.65,62.43 28.65,67.31 28.04,67.92 28.04,69.75 28.96,70.66 P8-2.33
N$76
  Top 0.254: X1.4 79.55,52.38 79.55,51.77 80.77,50.55 80.77,49.94 DS1307.2
N$77  (via drill 0.3)
  Top 0.508: 84.73,21.89 85.34,21.29 88.09,21.29 Q1.3 | 84.73,21.89 v82.91,20.07 | 84.73,21.89 DF.A
  Bottom 0.508: v82.91,20.07 78.94,24.03 73.15,24.03 RELAY.9
N$78
  Top 0.508: RLED1.1 7.01,35.92 4.57,35.92 TP3.1
N$82
  Bottom 0.254: U$1.91 21.03,11.53 17.98,11.53 15.85,9.4 15.85,7.87 14.63,6.65 P9-3.6
N$83
  Bottom 0.254: U$1.89 23.47,11.53 23.47,8.79 20.12,5.44 18.29,5.44 17.37,6.35 P9-3.4
N$84
  Top 0.254: U$1.87 26.21,11.53 21.34,6.65 19.81,6.65 P9-3.2
N$85
  Top 0.254: U$1.92 21.03,13.97 19.2,13.97 14.63,9.4 P9-3.5
N$86
  Top 0.254: U$1.90 23.47,13.97 22.86,13.97 21.64,12.75 20.73,12.75 17.37,9.4 P9-3.3
N$87
  Top 0.254: U$1.88 26.21,13.97 26.21,13.06 24.99,11.84 24.99,11.23 23.16,9.4 19.81,9.4 P9-3.1
N$95
  Top 0.254: U$1.68 51.82,13.97 51.82,13.06 53.03,11.84 53.03,9.4 52.12,8.48 P9-2.15
N$96
  Top 0.254: U$1.70 49.38,13.97 49.38,13.06 50.29,12.14 50.29,9.09 49.68,8.48 P9-2.17
N$97
  Top 0.254: U$1.72 46.63,13.97 46.63,13.36 47.85,12.14 47.85,9.4 46.94,8.48 P9-2.19
N$98
  Top 0.254: U$1.74 44.2,13.97 44.2,13.06 45.41,11.84 45.41,9.4 44.5,8.48 P9-2.21
N$99
  Top 0.254: U$1.76 41.76,13.97 41.76,13.06 42.67,12.14 42.67,9.09 42.06,8.48 P9-2.23
N$100
  Top 0.254: U$1.78 39.01,13.97 39.01,13.36 40.23,12.14 40.23,9.4 39.32,8.48 P9-2.25
N$101
  Top 0.254: U$1.80 36.58,13.97 36.58,13.06 37.8,11.84 37.8,9.4 36.88,8.48 P9-2.27
N$102
  Top 0.254: U$1.82 34.14,13.97 34.14,13.06 35.05,12.14 35.05,9.09 34.44,8.48 P9-2.29
N$103
  Top 0.254: U$1.84 31.39,13.97 31.39,13.36 32.61,12.14 32.61,9.4 31.7,8.48 P9-2.31
N$104
  Top 0.254: U$1.86 28.96,13.97 28.96,13.06 30.18,11.84 30.18,9.4 29.26,8.48 P9-2.33
N$112
  Top 0.254: U$1.67 51.51,11.53 51.51,9.4 50.9,8.79 50.9,6.96 51.82,6.04 P9-2.16
N$113
  Top 0.254: U$1.69 49.07,11.53 49.07,9.7 48.16,8.79 48.16,7.26 49.38,6.04 P9-2.18
N$114
  Top 0.254: U$1.71 46.33,11.53 46.33,9.4 45.72,8.79 45.72,7.26 46.94,6.04 P9-2.20
N$115
  Top 0.254: U$1.73 43.89,11.53 43.89,9.4 43.28,8.79 43.28,6.96 44.2,6.04 P9-2.22
N$116
  Top 0.254: U$1.75 41.45,11.53 41.45,9.7 40.54,8.79 40.54,7.26 41.76,6.04 P9-2.24
N$117
  Top 0.254: U$1.77 38.71,11.53 38.71,9.4 38.1,8.79 38.1,7.26 39.32,6.04 P9-2.26
N$118
  Top 0.254: U$1.79 36.27,11.53 36.27,9.4 35.66,8.79 35.66,6.96 36.58,6.04 P9-2.28
N$119
  Top 0.254: U$1.81 33.83,11.53 33.83,9.7 32.92,8.79 32.92,7.26 34.14,6.04 P9-2.30
N$120
  Top 0.254: U$1.83 31.09,11.53 31.09,9.4 30.48,8.79 30.48,7.26 31.7,6.04 P9-2.32
N$121
  Top 0.254: U$1.85 28.65,11.53 28.65,9.4 28.04,8.79 28.04,6.96 28.96,6.04 P9-2.34
NC
  Top 0.508: RELAY.1 70.41,19.15 70.41,22.5 68.89,24.03 68.89,38.35 70.1,39.57 JP1.1
NO
  Top 0.508: RELAY.10 70.41,24.33 70.41,29.21 RLPORT.1
PWR_BUT
  Top 0.254: U$1.55 66.75,11.53 66.75,9.4 66.14,8.79 66.14,6.96 67.06,6.04 P9-2.4
QH*
  Top 0.254: 74HC595.9 49.38,51.77 63.09,51.77 68.89,57.56 83.21,57.56 89.61,51.16 EXTOUT1.7
RL  (via drill 0.3)
  Top 0.254: 87.17,15.49 87.17,18.85 Q1.1 | 87.17,15.49 80.77,15.49 78.33,13.06 78.33,4.52 76.2,2.39 69.19,2.39 v68.89,2.69 | 87.17,15.49 RQ.1 | U$1.62 60.66,12.75 60.66,11.23 59.74,10.31 59.74,8.48 P9-2.9
  Bottom 0.254: v68.89,2.69 66.14,5.44 66.14,6.04 64.92,7.26 64.31,7.26 63.4,8.18 63.4,8.79 61.87,10.31 61.27,10.31 60.66,10.92 60.66,12.75 U$1.62
RS
  Top 0.254: RR.2 89.31,10.92 87.48,10.92 RSU.1 87.17,10.62 87.17,6.35 84.73,3.91 78.64,3.91 75.59,0.86 66.45,0.86 62.79,4.52 60.96,4.52 59.74,5.74 P9-2.10 59.44,6.04 58.52,6.96 58.52,8.79 59.13,9.4 59.13,11.53 U$1.61
SCL
  Top 0.254: DS1307.6 79.55,43.84 79.55,44.45 78.94,45.06 73.76,45.06 67.97,39.27 67.97,21.59 66.75,20.37 59.13,20.37 55.78,17.02 55.78,14.88 55.47,14.58 55.47,13.06 54.25,11.84 U$1.65
  Bottom 0.254: P9-2.14 54.86,6.04 54.86,6.96 55.78,7.87 55.78,9.7 53.95,11.53 U$1.65
SDA  (via drill 0.3)
  Top 0.254: v78.33,40.49 78.33,43.54 DS1307.5 | v58.83,20.98 55.17,17.32 55.17,15.19 54.25,14.28 U$1.66
  Bottom 0.254: v58.83,20.98 v78.33,40.49 | P9-2.13 54.56,8.48 54.56,9.4 53.03,10.92 53.03,13.06 53.95,13.97 U$1.66
SYS_5V
  Top 0.508: U$1.54 69.49,13.97 69.49,11.84 U$1.53 69.49,11.53 69.49,8.79 69.8,8.48 P9-2.1 69.8,8.18 69.8,6.04 P9-2.2
SYS_RESET
  Bottom 0.508: U$1.56 66.75,14.28 66.14,14.28 64.92,15.49 64.01,15.49 63.09,14.58 63.09,10.92 64.31,9.7 65.84,9.7 67.06,8.48 P9-2.3
VCC
  Top 0.254: 43.59,56.03 44.5,56.03 ROE.2 | 43.59,56.03 41.15,56.03 C3.1 40.84,55.73 40.54,55.42 40.54,51.77 74HC595.16 | 43.59,56.03 45.72,53.9 46.33,53.9 47.85,52.38 47.85,51.77 74HC595.10 48.16,51.46 48.16,50.55 51.51,47.19 88.39,47.19 92.05,50.85 EXTOUT1.8 | U$1.49 74.68,11.84 74.68,13.97 U$1.50 | RSU.2 87.17,12.45 86.26,12.45 82.6,8.79 P9-1.3 82.6,8.48 82.6,6.35 P9-1.4
  Bottom 0.254: 83.82,10.01 82.6,8.79 P9-1.3 | 83.82,10.01 92.05,18.24 92.05,50.85 EXTOUT1.8 | 83.82,10.01 76.2,10.01 74.68,11.53 U$1.49
VIN
  Top 0.508: P9-1.6 80.16,6.35 80.16,8.48 P9-1.5 | U$1.51 71.93,11.84 71.93,13.97 U$1.52 72.24,14.28 75.59,17.63 | RLED1.2 9.14,35.92 7.32,37.74 7.32,39.27 PWR_LED.A 7.32,39.57 9.75,42.01 10.36,42.01 | 10.36,42.01 11.28,42.01 D3.C | 10.36,42.01 13.41,45.06 F2.2 13.72,45.36 13.72,46.28 15.54,48.11 15.54,50.55 12.19,53.9 10.36,53.9 10.06,54.2 10.06,61.21 11.28,62.43 16.76,62.43 21.03,58.17 87.17,58.17 89,59.99 92.66,59.99 93.57,59.08 93.57,50.55 81.99,38.96 | 81.99,39.88 81.99,43.54 DS1307.8 | 81.99,17.93 81.38,17.93 81.08,17.63 75.59,17.63 | 81.99,17.93 84.43,17.93 DF.C | 75.59,17.63 74.37,17.63 73.15,18.85 RELAY.2 | 81.99,17.93 81.99,38.96 | 81.99,38.96 81.99,39.88 | 81.99,39.88 C4.1
  Bottom 0.508: P9-1.5 79.86,8.79 74.98,8.79 72.24,11.53 U$1.51
VIN_PRE  (via drill 0.3)
  Top 0.508: 11.73,48.87 9.14,46.28 C2.+ | 11.73,48.87 11.89,49.02 13.41,49.02 F2.1 | 3.05,57.56 3.05,59.99 4.27,61.21 L1'.2 | 3.05,57.56 3.05,57.25 L1.2 3.05,57.56 | 3.05,57.56 11.73,48.87 | v21.03,49.33 23.16,49.33 IC1.4
  Bottom 0.508: v21.03,49.33 16.46,49.33 4.57,61.21 L1'.2

### Text on the board
tNames: P8 | P8 | P8 | 41 42 | 7 8 | 1 2 | EXTOUT | DOUT CLK LAT !OE | beagle.opensprinkler.com | v1.0 (Rev. Nov 2013) | OpenSprinkler Beagle | NC | +5V | CO | GND | COM | NO | P9 | P9 | P9 | 41 42 | 7 8 | 1 2
BoxDim: Serpac WM-032-I Enclosure | All units are in inch | Left | Right | Front | Bottom